# EAGLE schematic F7VO006ICD7FAPK (1) (EAGLE 9.6.2)
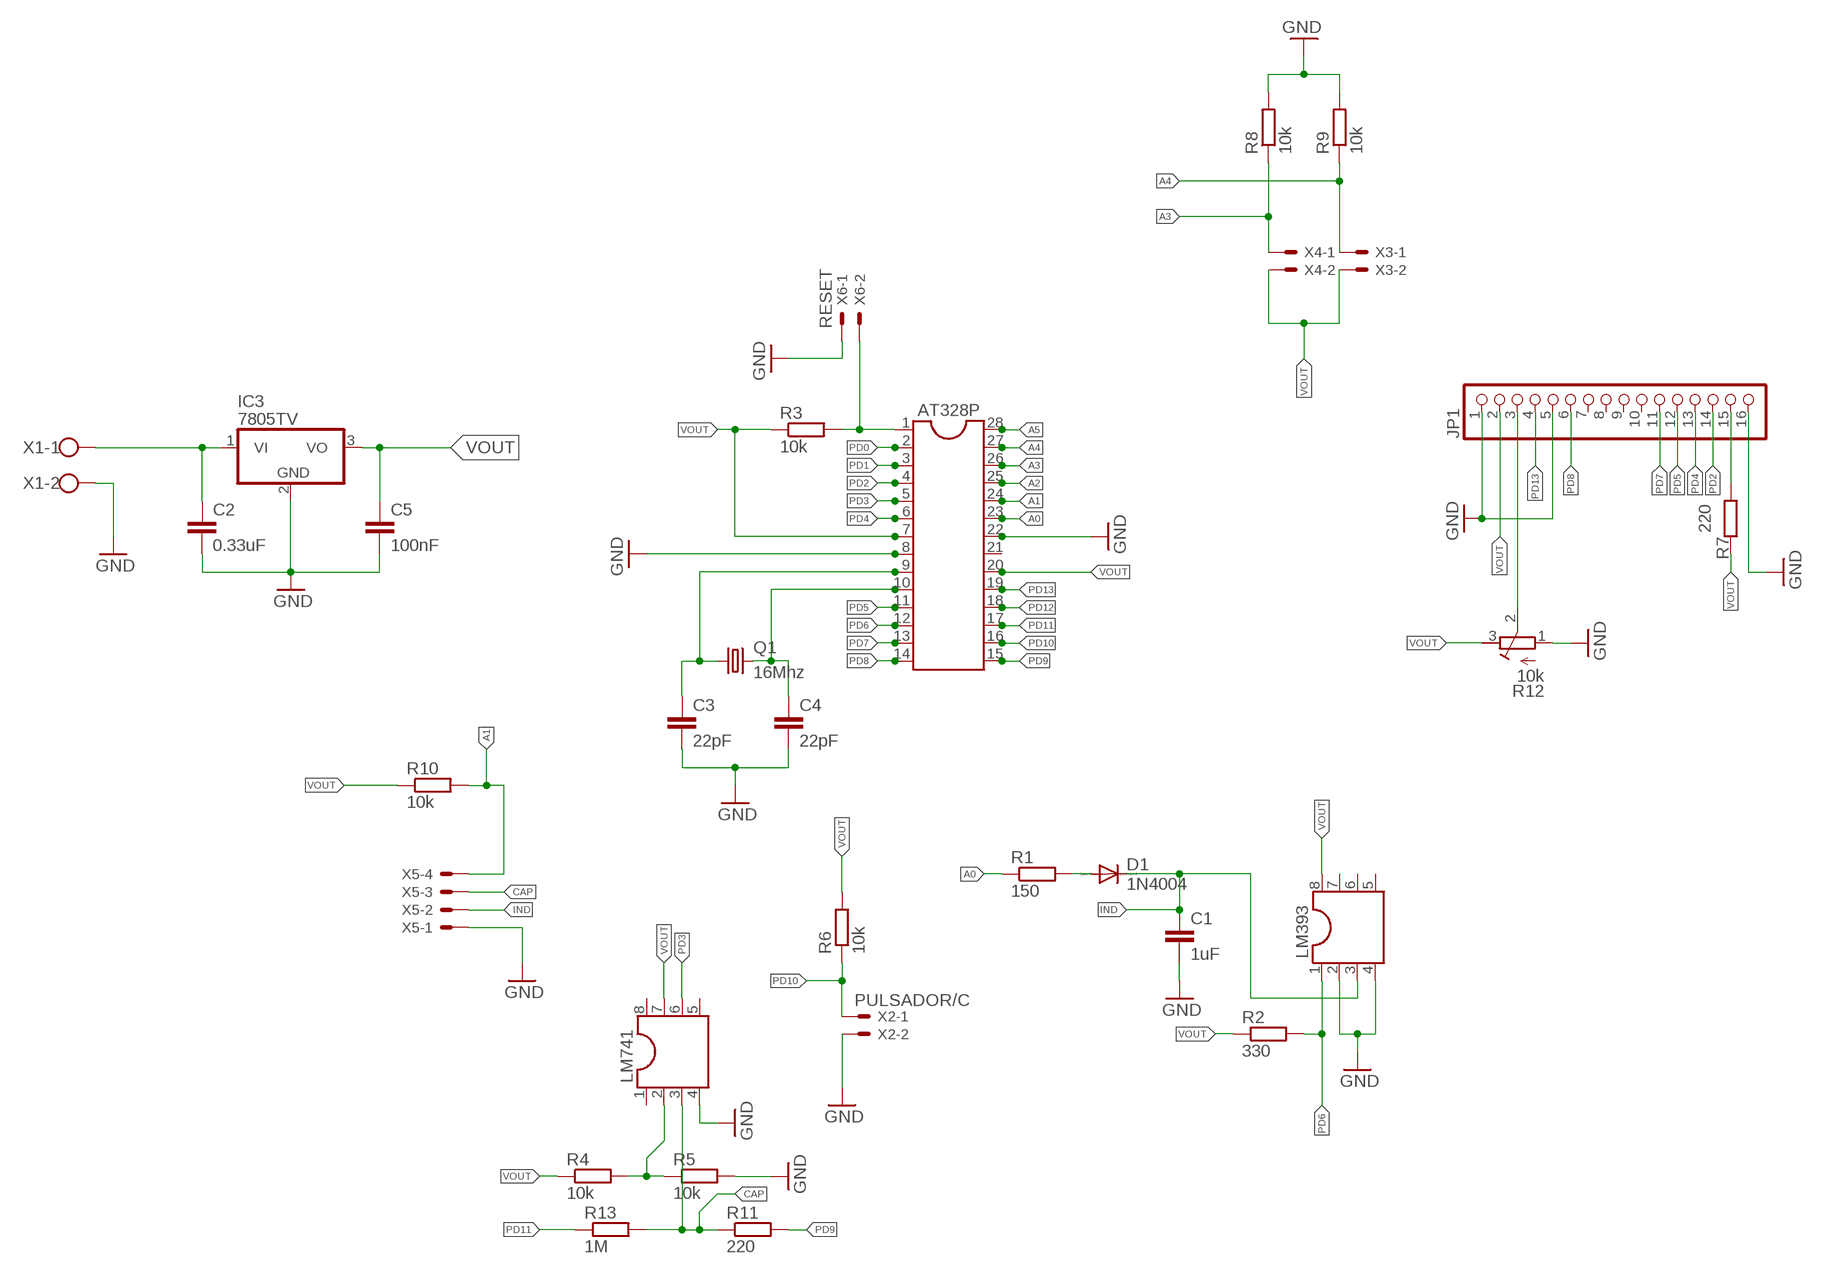
[diagram p0: schematic, sheet 1]

## Parts
AT328P  DIL28-3  [DIL28-3]
C1  1uF  C-EU050-024X044  [C050-024X044]
C2  0.33uF  C-EU050-024X044  [C050-024X044]
C3  22pF  C-EU025-030X050  [C025-030X050]
C4  22pF  C-EU025-030X050  [C025-030X050]
C5  100nF  C-EU025-030X050  [C025-030X050]
D1  1N4004  [DO41-10]
IC3  7805TV  [TO220V]
JP1  PINHD-1X16  [1X16]
LM393  DIL8S  [SOCKET-08]
LM741  DIL8S  [SOCKET-08]
Q1  16Mhz  CRYSTALHC49S  [HC49/S]
R1  150  R-EU_0207/7  [0207/7]
R2  330  R-EU_0207/7  [0207/7]
R3  10k  R-EU_0207/7  [0207/7]
R4  10k  R-EU_0207/7  [0207/7]
R5  10k  R-EU_0207/7  [0207/7]
R6  10k  R-EU_0207/7  [0207/7]
R7  220  R-EU_0207/7  [0207/7]
R8  10k  R-EU_0207/7  [0207/7]
R9  10k  R-EU_0207/7  [0207/7]
R10  10k  R-EU_0207/7  [0207/7]
R11  220  R-EU_0207/7  [0207/7]
R12  10k  R-TRIMM64W  [RTRIM64W]
R13  1M  R-EU_0207/7  [0207/7]
X1  W237-102  [W237-102]
X2  PULSADOR/C  22-23-2021  [22-23-2021]
X3  22-23-2021  [22-23-2021]
X4  22-23-2021  [22-23-2021]
X5  22-23-2041  [22-23-2041]
X6  RESET  22-23-2021  [22-23-2021]

## Nets
A0: AT328P.23 R1.1
A1: AT328P.24 R10.2 X5.4
A2: AT328P.25
A3: AT328P.26 R8.1 X4.1
A4: AT328P.27 R9.1 X3.1
A5: AT328P.28
CAP: LM741.3 R11.1 R13.2 X5.3
GND: AT328P.8 AT328P.22 C1.2 C2.2 C3.2 C4.2 C5.2 IC3.2(GND) JP1.1 JP1.5 JP1.16 LM393.2 LM393.4 LM741.4 R5.2 R8.2 R9.2 R12.1(A) X1.2 X2.2 X5.1 X6.1
IND: C1.1 D1.C LM393.3 X5.2
N$1: AT328P.1 R3.2 X6.2
N$2: C2.1 IC3.1(VI) X1.1
N$3: LM741.2 R4.2 R5.1
N$4: AT328P.9 C3.1 Q1.1
N$5: AT328P.10 C4.1 Q1.2
N$6: JP1.15 R7.2
N$7: D1.A R1.2
N$8: JP1.3 R12.2(S)
PD0: AT328P.2
PD1: AT328P.3
PD2: AT328P.4 JP1.14
PD3: AT328P.5 LM741.6
PD4: AT328P.6 JP1.13
PD5: AT328P.11 JP1.12
PD6: AT328P.12 LM393.1 R2.2
PD7: AT328P.13 JP1.11
PD8: AT328P.14 JP1.6
PD9: AT328P.15 R11.2
PD10: AT328P.16 R6.1 X2.1
PD11: AT328P.17 R13.1
PD12: AT328P.18
PD13: AT328P.19 JP1.4
VOUT: AT328P.7 AT328P.20 C5.1 IC3.3(VO) JP1.2 LM393.8 LM741.7 R2.1 R3.1 R4.1 R6.2 R7.1 R10.1 R12.3(E) X3.2 X4.2
Unconnected: AT328P.21 JP1.7 JP1.8 JP1.9 JP1.10 LM393.5 LM393.6 LM393.7 LM741.1 LM741.5 LM741.8

## Library data of the parts
AT328P = ic-package:DIL28: Dual In Line
C1-C5 = rcl:C-EU: CAPACITOR, European symbol
D1 = diode:1N4004: DIODE general purpose rectifier, 1 A
IC3 = linear:78*: Positive VOLTAGE REGULATOR Source: http://cache.national.com/ds/LM/LM78L05.pdf http://www.fairchildsemi.com/ds/LM/LM7805.pdf
JP1 = pinhead:PINHD-1X16: PIN HEADER
LM393 LM741 = ic-package:DIL8: Dual In Line / Socket
Q1 = crystal:CRYSTAL: CRYSTAL; OC_FARNELL: 1667008; OC_NEWARK: unknown
R1-R11 R13 = rcl:R-EU_: RESISTOR, European symbol
R12 = rcl:R-TRIMM: Trimm resistor
X1 = con-wago-500:W237-102: WAGO SCREW CLAMP; MPN: 237-102; OC_FARNELL: unknown; OC_NEWARK: 70K9898
X2-X4 X6 = con-molex:22-23-2021: .100" (2.54mm) Center Header - 2 Pin; MF: MOLEX; MPN: 22-23-2021; OC_FARNELL: 1462926; OC_NEWARK: 25C3832
X5 = con-molex:22-23-2041: .100" (2.54mm) Center Header - 4 Pin; MF: MOLEX; MPN: 22-23-2041; OC_FARNELL: 1462920; OC_NEWARK: 38C0355